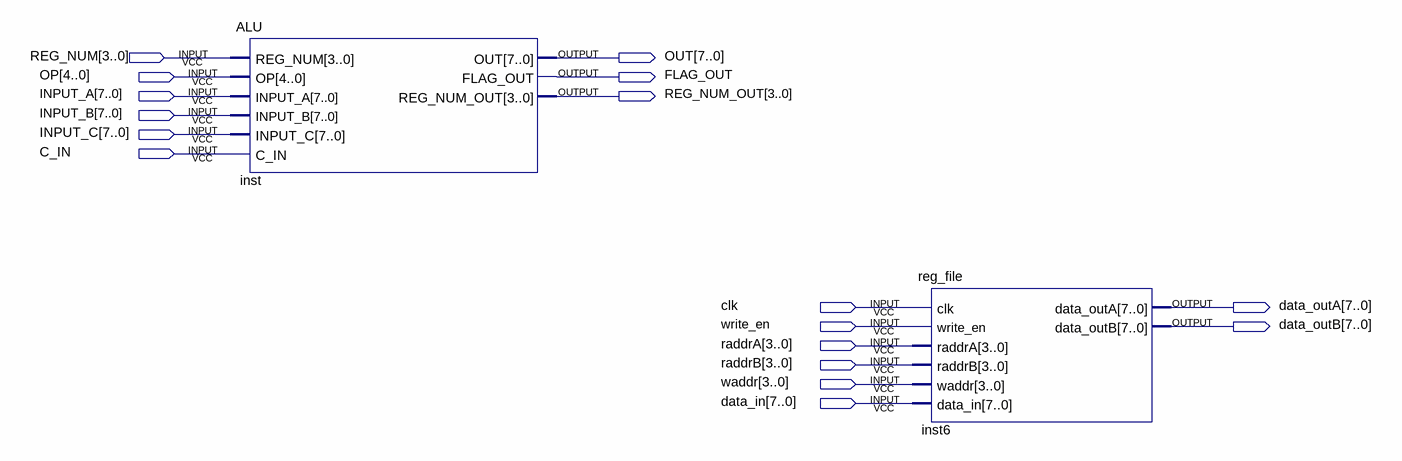
[diagram p0: schematic sheet]
// Quartus schematic Lab2.bdf as structural Verilog: 2 symbols, 17 pins
module Lab2 (
  input  [3:0] REG_NUM,
  input  [4:0] OP,
  input  [7:0] INPUT_A,
  input  [7:0] INPUT_B,
  input  [7:0] INPUT_C,
  input  C_IN,
  input  clk,
  input  write_en,
  input  [3:0] raddrA,
  input  [3:0] raddrB,
  input  [3:0] waddr,
  input  [7:0] data_in,
  output [7:0] OUT,
  output FLAG_OUT,
  output [3:0] REG_NUM_OUT,
  output [7:0] data_outA,
  output [7:0] data_outB
);

  ALU inst (
    .REG_NUM(REG_NUM), .OUT(OUT), .FLAG_OUT(FLAG_OUT), .REG_NUM_OUT(REG_NUM_OUT));  // open: OP, INPUT_A, INPUT_B, INPUT_C, C_IN
  reg_file inst6 (.data_outA(data_outA), .data_outB(data_outB));  // open: clk, write_en, raddrA, raddrB, waddr, data_in
endmodule
